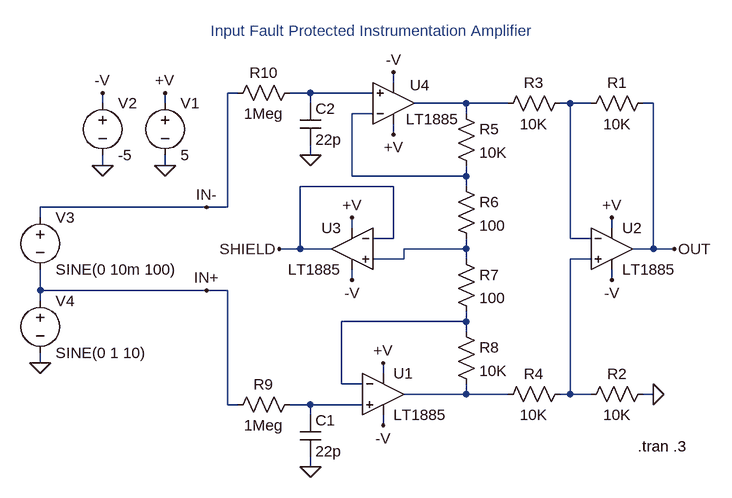
[diagram p0: schematic 1885.asc]
1885.asc, the LTspice schematic file:
Version 4
SHEET 1 896 680
WIRE 224 -240 224 -256
WIRE -16 -224 -32 -224
WIRE 96 -224 64 -224
WIRE 192 -224 96 -224
WIRE -224 -208 -224 -224
WIRE -128 -208 -128 -224
WIRE 96 -208 96 -224
WIRE 336 -208 256 -208
WIRE 400 -208 336 -208
WIRE 496 -208 480 -208
WIRE 528 -208 496 -208
WIRE 624 -208 608 -208
WIRE 192 -192 160 -192
WIRE 336 -192 336 -208
WIRE 224 -160 224 -176
WIRE 96 -128 96 -144
WIRE -224 -112 -224 -128
WIRE -128 -112 -128 -128
WIRE 160 -96 160 -192
WIRE 336 -96 336 -112
WIRE 336 -96 160 -96
WIRE 224 -80 80 -80
WIRE 336 -80 336 -96
WIRE -64 -48 -320 -48
WIRE -32 -48 -32 -224
WIRE -32 -48 -64 -48
WIRE -320 -32 -320 -48
WIRE 160 -16 160 -32
WIRE 560 -16 560 -32
WIRE 224 0 224 -80
WIRE 224 0 192 0
WIRE 496 0 496 -208
WIRE 528 0 496 0
WIRE 80 16 80 -80
WIRE 80 16 48 16
WIRE 128 16 80 16
WIRE 336 16 336 0
WIRE 336 16 240 16
WIRE 624 16 624 -208
WIRE 624 16 592 16
WIRE 656 16 624 16
WIRE 240 32 240 16
WIRE 240 32 192 32
WIRE 336 32 336 16
WIRE 528 32 496 32
WIRE 160 64 160 48
WIRE 560 64 560 48
WIRE -320 80 -320 48
WIRE -64 80 -320 80
WIRE -32 80 -64 80
WIRE -320 96 -320 80
WIRE 336 128 336 112
WIRE 336 128 144 128
WIRE 336 144 336 128
WIRE -320 192 -320 176
WIRE 208 208 208 192
WIRE 144 224 144 128
WIRE 176 224 144 224
WIRE 336 240 336 224
WIRE 336 240 240 240
WIRE 400 240 336 240
WIRE 496 240 496 32
WIRE 496 240 480 240
WIRE 528 240 496 240
WIRE 624 240 608 240
WIRE -32 256 -32 80
WIRE -16 256 -32 256
WIRE 96 256 64 256
WIRE 176 256 96 256
WIRE 96 272 96 256
WIRE 208 288 208 272
WIRE 96 352 96 336
FLAG -128 -112 0
FLAG 208 192 +V
FLAG -128 -224 +V
FLAG 208 288 -V
FLAG -224 -112 0
FLAG -224 -224 -V
FLAG 560 -32 +V
FLAG 560 64 -V
FLAG 160 -32 +V
FLAG 160 64 -V
FLAG 224 -160 +V
FLAG 224 -256 -V
FLAG 624 240 0
FLAG 96 352 0
FLAG 96 -128 0
FLAG -320 192 0
FLAG 656 16 OUT
FLAG -64 -48 IN-
FLAG -64 80 IN+
FLAG 48 16 SHIELD
SYMBOL voltage -128 -224 R0
SYMATTR InstName V1
SYMATTR Value 5
SYMBOL voltage -224 -224 R0
SYMATTR InstName V2
SYMATTR Value -5
SYMBOL res 624 -224 R90
WINDOW 0 0 56 VBottom 2
WINDOW 3 32 56 VTop 2
SYMATTR InstName R1
SYMATTR Value 10K
SYMBOL res 624 224 R90
WINDOW 0 0 56 VBottom 2
WINDOW 3 32 56 VTop 2
SYMATTR InstName R2
SYMATTR Value 10K
SYMBOL res 496 -224 R90
WINDOW 0 0 56 VBottom 2
WINDOW 3 32 56 VTop 2
SYMATTR InstName R3
SYMATTR Value 10K
SYMBOL res 496 224 R90
WINDOW 0 0 56 VBottom 2
WINDOW 3 32 56 VTop 2
SYMATTR InstName R4
SYMATTR Value 10K
SYMBOL res 320 -208 R0
SYMATTR InstName R5
SYMATTR Value 10K
SYMBOL res 320 -96 R0
SYMATTR InstName R6
SYMATTR Value 100
SYMBOL res 320 16 R0
SYMATTR InstName R7
SYMATTR Value 100
SYMBOL res 320 128 R0
SYMATTR InstName R8
SYMATTR Value 10K
SYMBOL cap 80 272 R0
SYMATTR InstName C1
SYMATTR Value 22p
SYMBOL res 80 240 R90
WINDOW 0 0 56 VBottom 2
WINDOW 3 32 56 VTop 2
SYMATTR InstName R9
SYMATTR Value 1Meg
SYMBOL cap 80 -208 R0
SYMATTR InstName C2
SYMATTR Value 22p
SYMBOL res 80 -240 R90
WINDOW 0 0 56 VBottom 2
WINDOW 3 32 56 VTop 2
SYMATTR InstName R10
SYMATTR Value 1Meg
SYMBOL voltage -320 -48 R0
SYMATTR InstName V3
SYMATTR Value SINE(0 10m 100)
SYMBOL voltage -320 80 R0
SYMATTR InstName V4
SYMATTR Value SINE(0 1 10)
SYMBOL opamps\\LT1885 208 240 R0
SYMATTR InstName U1
SYMBOL opamps\\LT1885 560 16 R0
SYMATTR InstName U2
SYMBOL opamps\\LT1885 160 16 M0
SYMATTR InstName U3
SYMBOL opamps\\LT1885 224 -208 M180
WINDOW 0 25 28 Left 2
WINDOW 3 19 -24 Left 2
SYMATTR InstName U4
TEXT 192 -304 Bottom 2 ;Input Fault Protected Instrumentation Amplifier
TEXT 600 320 Left 2 !.tran .3

The netlist it stands for:
* 1885.asc
V1 +V 0 5
V2 -V 0 -5
R1 OUT N003 10K
R2 0 N006 10K
R3 N003 N002 10K
R4 N006 N008 10K
R5 N002 N004 10K
R6 N004 N005 100
R7 N005 N007 100
R8 N007 N008 10K
C1 N009 0 22p
R9 N009 IN+ 1Meg
C2 N001 0 22p
R10 N001 IN- 1Meg
V3 IN- IN+ SINE(0 10m 100)
V4 IN+ 0 SINE(0 1 10)
* U1: LT1885 (symbol opamps\LT1885 not available, pins judged from their places): In+=N009 In-=N007 V+=+V V-=-V OUT=N008
* U2: LT1885 (symbol opamps\LT1885 not available, pins judged from their places): In+=N006 In-=N003 V+=+V V-=-V OUT=OUT
* U3: LT1885 (symbol opamps\LT1885 not available, pins judged from their places): In+=N005 In-=SHIELD V+=+V V-=-V OUT=SHIELD
* U4: LT1885 (symbol opamps\LT1885 not available, pins judged from their places): In+=N001 In-=N004 V+=+V V-=-V OUT=N002
* Input Fault Protected Instrumentation Amplifier
.tran .3
.backanno
.end